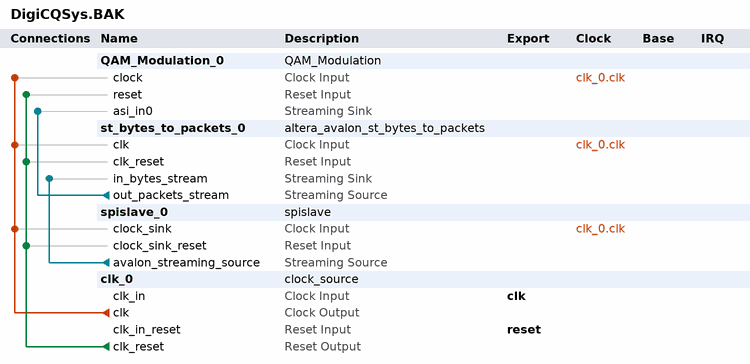
[diagram p0: system contents]
# Platform Designer (Qsys) system DigiCQSys.BAK, Cyclone V 5CSXFC6D6F31C6
# Parameters at their usual value, and those the tool derives, are not listed.
package require -exact qsys 18.0
create_system DigiCQSys.BAK
set_project_property DEVICE_FAMILY {Cyclone V}
set_project_property DEVICE 5CSXFC6D6F31C6

add_instance QAM_Modulation_0 QAM_Modulation 1.0
set_instance_parameter_value QAM_Modulation_0 PACKET_LENGTH 1024

add_instance st_bytes_to_packets_0 altera_avalon_st_bytes_to_packets 18.0
set_instance_parameter_value st_bytes_to_packets_0 CHANNEL_WIDTH 8
set_instance_parameter_value st_bytes_to_packets_0 ENCODING 0

add_instance spislave_0 spislave 18.0
set_instance_parameter_value spislave_0 SYNC_DEPTH 2

add_instance clk_0 clock_source 18.0
set_instance_parameter_value clk_0 clockFrequency 50000000

# connections
add_connection clk_0.clk QAM_Modulation_0.clock clock
add_connection clk_0.clk spislave_0.clock_sink clock
add_connection clk_0.clk st_bytes_to_packets_0.clk clock
add_connection clk_0.clk_reset QAM_Modulation_0.reset reset
add_connection clk_0.clk_reset spislave_0.clock_sink_reset reset
add_connection clk_0.clk_reset st_bytes_to_packets_0.clk_reset reset
add_connection spislave_0.avalon_streaming_source st_bytes_to_packets_0.in_bytes_stream avalon_streaming
add_connection st_bytes_to_packets_0.out_packets_stream QAM_Modulation_0.asi_in0 avalon_streaming

# exported interfaces
add_interface clk clock sink
set_interface_property clk EXPORT_OF clk_0.clk_in
add_interface reset reset sink
set_interface_property reset EXPORT_OF clk_0.clk_in_reset

set_interconnect_requirement {$system} qsys_mm.clockCrossingAdapter HANDSHAKE
set_interconnect_requirement {$system} qsys_mm.enableEccProtection FALSE
set_interconnect_requirement {$system} qsys_mm.insertDefaultSlave FALSE
set_interconnect_requirement {$system} qsys_mm.maxAdditionalLatency 1

save_system DigiCQSys.BAK.qsys
